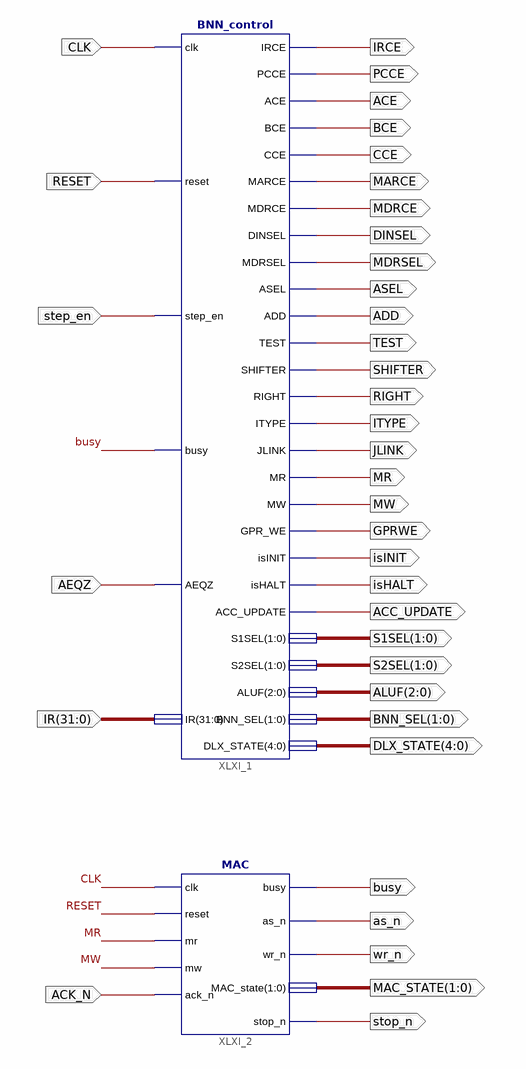
[diagram p0: schematic sheet 1]
// Xilinx ISE schematic FULL_BNN_Control.sch (spartan6) as structural Verilog: 2 symbols, 38 ports
module FULL_BNN_Control (
  input  CLK,
  input  RESET,
  input  step_en,
  input  AEQZ,
  input  [31:0] IR,
  input  ACK_N,
  output busy,
  output as_n,
  output wr_n,
  output [1:0] MAC_STATE,
  output stop_n,
  output IRCE,
  output PCCE,
  output ACE,
  output BCE,
  output CCE,
  output MARCE,
  output MDRCE,
  output DINSEL,
  output MDRSEL,
  output ASEL,
  output ADD,
  output TEST,
  output SHIFTER,
  output RIGHT,
  output ITYPE,
  output JLINK,
  output MR,
  output MW,
  output GPRWE,
  output isINIT,
  output isHALT,
  output ACC_UPDATE,
  output [1:0] S1SEL,
  output [1:0] S2SEL,
  output [2:0] ALUF,
  output [1:0] BNN_SEL,
  output [4:0] DLX_STATE
);

  BNN_control XLXI_1 (
    .clk(CLK), .reset(RESET), .step_en(step_en), .busy(busy), .AEQZ(AEQZ), .IR(IR), .IRCE(IRCE), .PCCE(PCCE),
    .ACE(ACE), .BCE(BCE), .CCE(CCE), .MARCE(MARCE), .MDRCE(MDRCE), .DINSEL(DINSEL), .MDRSEL(MDRSEL),
    .ASEL(ASEL), .ADD(ADD), .TEST(TEST), .SHIFTER(SHIFTER), .RIGHT(RIGHT), .ITYPE(ITYPE), .JLINK(JLINK),
    .MR(MR), .MW(MW), .GPR_WE(GPRWE), .isINIT(isINIT), .isHALT(isHALT), .ACC_UPDATE(ACC_UPDATE),
    .S1SEL(S1SEL), .S2SEL(S2SEL), .ALUF(ALUF), .BNN_SEL(BNN_SEL), .DLX_STATE(DLX_STATE));
  MAC XLXI_2 (
    .ack_n(ACK_N), .clk(CLK), .mr(MR), .mw(MW), .reset(RESET), .as_n(as_n), .busy(busy), .wr_n(wr_n),
    .stop_n(stop_n), .MAC_state(MAC_STATE));
endmodule
